# EAGLE design Atom_Multiout_Main (EAGLE 9.1.3)
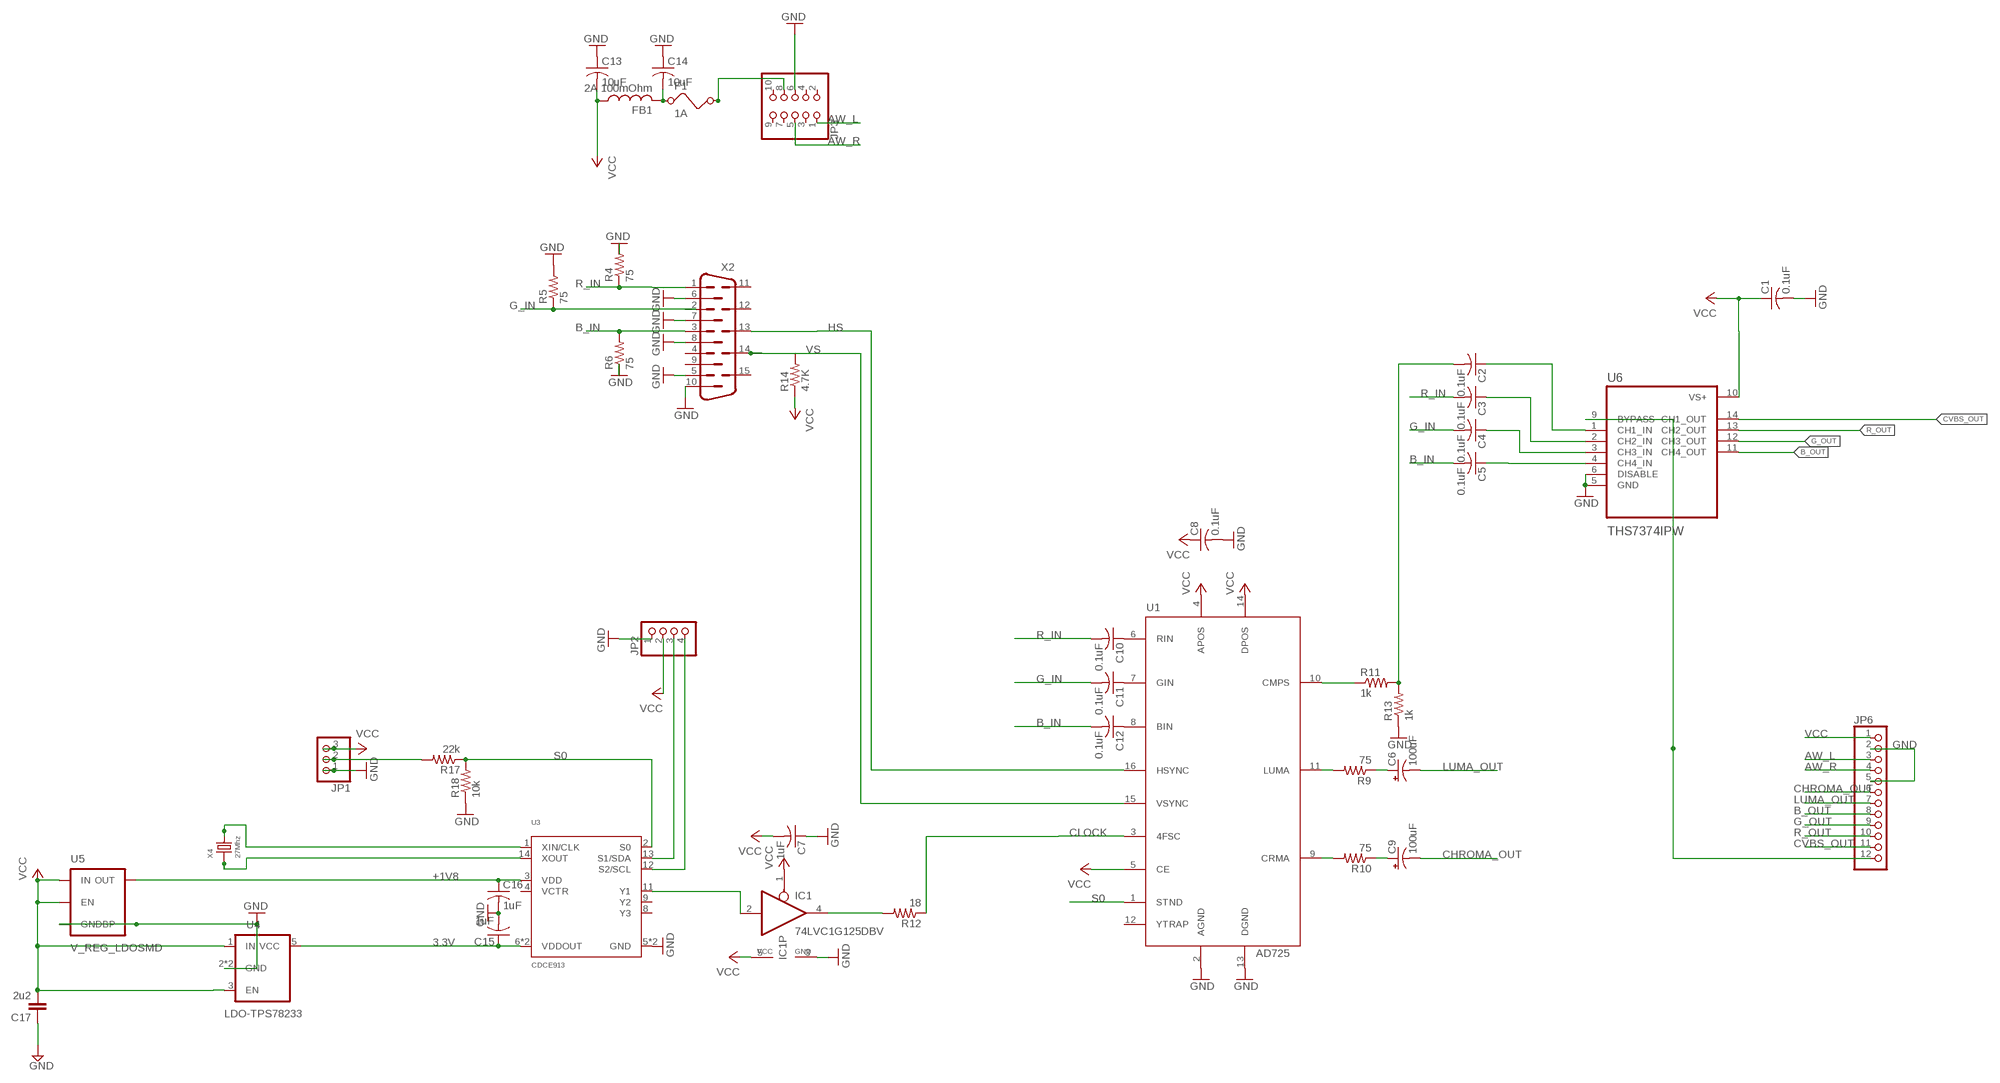
[diagram p0: schematic, sheet 1]

## Parts
C1  0.1uF  C-USC0603  [C0603@1]
C2  0.1uF  C-USC0603  [C0603@1]
C3  0.1uF  C-USC0603  [C0603@1]
C4  0.1uF  C-USC0603  [C0603@1]
C5  0.1uF  C-USC0603  [C0603@1]
C6  100uF  CPOL-USC/6032-28R  [C/6032-28R]
C7  1uF  C-USC0603  [C0603@1]
C8  0.1uF  C-USC0603  [C0603@1]
C9  100uF  CPOL-USC/6032-28R  [C/6032-28R]
C10  0.1uF  C-USC0603  [C0603@1]
C11  0.1uF  C-USC0603  [C0603@1]
C12  0.1uF  C-USC0603  [C0603@1]
C13  10uF  C-USC0603  [C0603@1]
C14  10uF  C-USC0603  [C0603@1]
C15  1uF  C-USC0603  [C0603@1]
C16  1uF  C-USC0603  [C0603@1]
C17  2u2  C-EUC0603  [C0603]
F1  1A  FUSEF  [1812]
FB1  2A 100mOhm  FERRITE-BEADB  [0805]
IC1  74LVC1G125DBV  [SOT23-5]
JP1  PINHD-1X03_2.54-S  [1X03-S]
JP2  PINHD-1X04_2.00  [1X04M]
JP3  PINHD-2X05_2.00  [2X05M]
JP6  PINHD-1X12_2.54-S  [1X12-S]
R4  75  R-US_R0603  [R0603]
R5  75  R-US_R0603  [R0603]
R6  75  R-US_R0603  [R0603]
R9  75  R-US_R0603  [R0603]
R10  75  R-US_R0603  [R0603]
R11  1k  R-US_R0603  [R0603]
R12  18  R-US_R0603  [R0603]
R13  1k  R-US_R0603  [R0603]
R14  4.7K  R-US_R0603  [R0603]
R17  22k  R-US_R0603  [R0603]
R18  10k  R-US_R0603  [R0603]
U1  AD725  [SOIC16W]
U3  CDCE913  [TSSOP14]
U4  LDO-TPS78233  [SOT23-5]
U5  V_REG_LDOSMD  [SOT23-5]
U6  THS7374IPW  [SOP65P640X120-14N]
X2  HM15V  [HDM15V]
X4  27Mhz  CRYSTAL'5032'  [X2-SMD-5.0X3.2X1.3MM]

## Nets
3.3V: C15.1 U3.6(VDDOUT) U3.7(VDDOUT) U4.5(VCC)
+1V8: C16.1 U3.3(VDD) U5.5(OUT)
AW_L: JP3.1 JP6.3
AW_R: JP3.5 JP6.4
B_IN: C5.2 C12.2 R6.2 X2.3
B_OUT: JP6.8 U6.11(CH4_OUT)
CHROMA_OUT: C9.- JP6.6
CLOCK: R12.1 U1.3(4FSC)
CVBS_OUT: JP6.11 U6.14(CH1_OUT)
G_IN: C4.2 C11.2 R5.1 X2.2
G_OUT: JP6.9 U6.12(CH3_OUT)
GND: C1.2 C7.1 C8.2 C13.1 C14.1 C15.2 C16.2 C17.1 IC1.3(GND) JP1.1 JP2.1 JP3.6 JP6.2 JP6.5 R4.2 R5.2 R6.1 R13.1 R18.1 U1.2(AGND) U1.13(DGND) U3.5(GND) U3.10(GND) U4.2(GND) U4.4(GND) U5.2(GND) U5.4(BP) U6.5(GND) U6.6(DISABLE) X2.5 X2.6 X2.7 X2.8 X2.10
HS: U1.16(HSYNC) X2.13
LPF: JP6.12 U6.9(BYPASS)
LUMA_OUT: C6.- JP6.7
N$6: C2.1 U6.1(CH1_IN)
N$7: IC1.4(O) R12.2
N$8: C4.1 U6.3(CH3_IN)
N$9: C3.1 U6.2(CH2_IN)
N$10: C5.1 U6.4(CH4_IN)
N$11: C2.2 R11.2 R13.2
N$12: R11.1 U1.10(CMPS)
N$13: C10.1 U1.6(RIN)
N$14: C11.1 U1.7(GIN)
N$15: C12.1 U1.8(BIN)
N$16: R9.2 U1.11(LUMA)
N$17: R10.2 U1.9(CRMA)
N$18: C6.+ R9.1
N$19: C9.+ R10.1
N$20: F1.2 JP3.8
N$21: C14.2 F1.1 FB1.2
N$22: IC1.2(I) U3.11(Y1)
N$24: JP1.2 R17.2
N$25: U3.1(XIN/CLK) X4.2
N$26: U3.14(XOUT) X4.1
N$27: JP2.3 U3.13(S1/SDA)
N$28: JP2.4 U3.12(S2/SCL)
R_IN: C3.2 C10.2 R4.1 X2.1
R_OUT: JP6.10 U6.13(CH2_OUT)
S0: R17.1 R18.2 U1.1(STND) U3.2(S0)
VCC: C1.1 C7.2 C8.1 C13.2 C17.2 FB1.1 IC1.1(OE) IC1.5(VCC) JP1.3 JP2.2 JP6.1 R14.1 U1.4(APOS) U1.5(CE) U1.14(DPOS) U4.1(IN) U4.3(EN) U5.1(IN) U5.3(EN) U6.10(VS+)
VS: R14.2 U1.15(VSYNC) X2.14
Unconnected: JP3.2 JP3.3 JP3.4 JP3.7 JP3.9 JP3.10 U1.12(YTRAP) U3.4(VCTR) U3.8(Y3) U3.9(Y2) X2.4 X2.9 X2.11 X2.12 X2.15

## Library data of the parts
C1-C5 C7 C8 C10-C16 = resistor:C-US: CAPACITOR, American symbol
C6 C9 = adafruit:CPOL-US: POLARIZED CAPACITOR, American symbol
C17 = resistor:C-EU: CAPACITOR, European symbol
F1 = m-pad-2.1:FUSE: Fuse's in various packages
FB1 = m-pad-2.1:FERRITE-BEAD: Ferrite beads in various packages
IC1 = 74xx-little-us:74*1G125: Single Bus Buffer Gate with 3-State Output
JP1 = pinhead-2:PINHD-1X03: PIN HEADER
JP2 = pinhead-2:PINHD-1X04: PIN HEADER
JP3 = pinhead-2:PINHD-2X05: PIN HEADER
JP6 = pinhead-2:PINHD-1X12: PIN HEADER
R4-R6 R9-R14 R17 R18 = resistor:R-US_: RESISTOR, American symbol
U1 = m-pad-2.1:AD725: Analog Devices AD725 Low Cost RGB to NTSC/PAL Encoder with Luma Trap Port Description: The AD725 is a very low cost general purpose RGB to NTSC/ PAL encoder that converts red, green and blue color component signals into their corresponding luminance (baseband amplitude) and chrominance (subcarrier amplitude and phase) signals in accordance with either NTSC or PAL standards. These two outputs are also combined on-chip to provide a composite video output. All three outputs are available separately at voltages of twice the standard signal levels as required for driving 75 Ohm, reverse-terminated cables. The AD725 features a luminance trap (YTRAP) pin that provides a means of reducing cross color generated by subcarrier frequency components found in the luminance signal. For portable or other power-sensitive applications, the device can be powered down to less than 1 uA of current consumption. All logic levels are TTL compatible thus supporting the logic requirements of 3 V CMOS systems. The AD725 is packaged in a low cost 16-lead SOIC and operates from a +5 V supply. Features: Composite Video Output: Both NTSC and PAL Chrominance and Luminance (S-Video) Outputs Luma Trap Port to Eliminate Cross Color Artifacts TTL Logic Levels Integrated Delay Line and Auto-Tuned Filters Drives 75 Ohm Reverse-Terminated Loads Low Power +5 V Operation Power-Down to less then 1 uA Very Low Cost Applications: RGB/VGA to NTSC/PAL Encoding Personal Computers/Network Computers Video Games Video Conference Cameras Digital Still Cameras Please send any comments to: messi@users.sourceforge.net
U3 = TRP_Custom:CDCE913: CDCEx913 Programmable 1-PLL VCXO Clock Synthesizer With 1.8-V, 2.5-V, and 3.3-V Outputs http://www.ti.com/product/CDCE913
U4 = SparkFun-PowerIC:LDO-TPS78233: Voltage Regulator LDO 500nA Ground Current, 150mA, Ultra-Low Quiescent Current Low-Dropout Linear Regulator.
U5 = SparkFun-PowerIC:V_REG_LDO: Voltage Regulator LDO Standard 150mA LDO voltage regulator in SOT-23 layout. Micrel part MIC5205. BP (by-pass) pin is used to lower output noise with 470pF cap.
U6 = THS7374IPW:THS7374IPW: Check availability <https://pricing.snapeda.com/parts/THS7374IPW/Texas%20Instruments/view-part?ref=eda>; AVAILABILITY: In Stock; DESCRIPTION: 4-Ch SDTV (Component and Composite) Video Amplifier with 9.5MHz Filters and 6dB Gain; MF: Texas Instruments; MP: THS7374IPW; PACKAGE: TSSOP-14 Texas Instruments; PRICE: None; PURCHASE-URL: https://pricing.snapeda.com/search/part/THS7374IPW/?ref=eda
X2 = con-subd:HM15: SUB-D; OC_FARNELL: unknown; OC_NEWARK: unknown
X4 = Seeed-OPL-Crystal-Oscillator:CRYSTAL

## Board
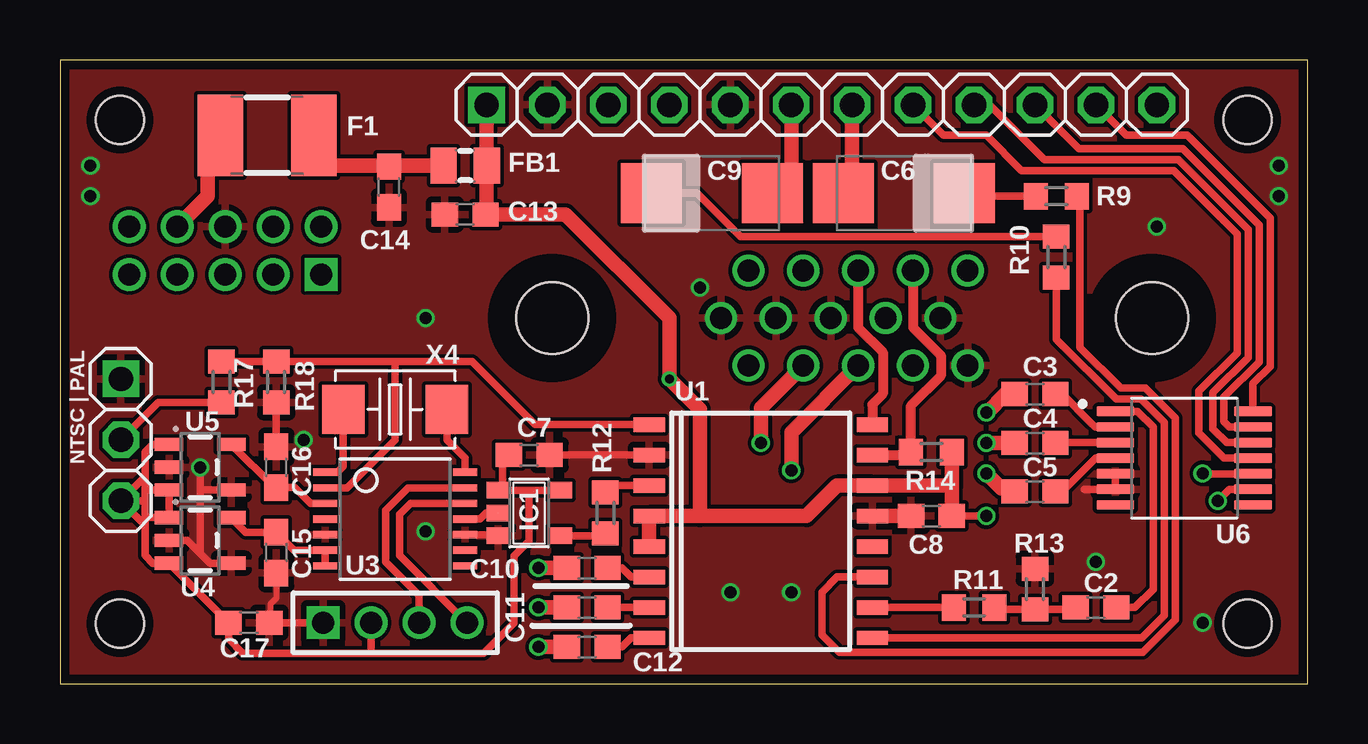
[diagram p1: board, top side]
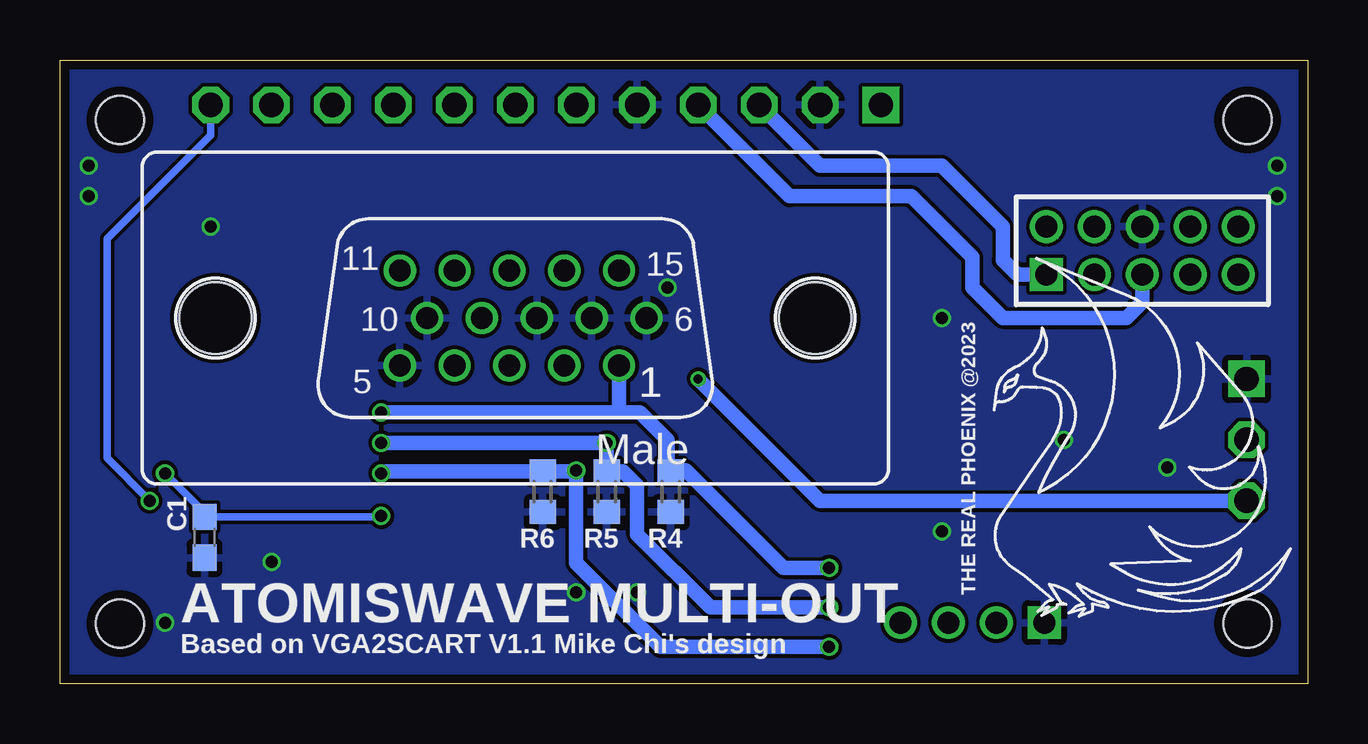
[diagram p2: board, bottom side, seen from below]

Size 52 x 26 mm. Coordinates in mm from the lower left corner, seen from the top.
Outline: 0,0 52,0 52,26 0,26 0,0
Copper layers (1*16): Top 0.035559375mm / dielectric 1.6mm / Bottom 0.035559375mm
Design rules "oshpark-2layer": minimum track width 6mil, minimum drill 10mil, track to track 6mil, track to pad 6mil, pad to pad 6mil, via to via 6mil, smd to smd 6mil, copper to edge 15mil, drill to drill 6mil, minimum pad ring 5mil, minimum via ring 5mil, stop-mask expansion 2.5mil, vias tented up to drill 30mil, thermal gap 10mil
Holes 2 mm at 49.5,23.5 2.5,23.5 2.5,2.5 49.5,2.5

### Footprints (pad centres in the part's own frame; a part is rotated, then mirrored left to right if it is on the bottom)
C0603@1 = smd 1.1 x 1: 1 -0.85,0; 2 0.85,0
C/6032-28R = smd 2.55 x 2.5: + 2.525,0; - -2.525,0
C0603 = smd 1.1 x 1: 1 -0.85,0; 2 0.85,0
1812 = smd 1.9 x 3.4: 1 -1.95,0; 2 1.95,0
0805 = smd 1.1 x 1.5: 1 -0.9,0; 2 0.9,0
SOT23-5 = smd 0.69 x 0.99: 1 -0.95,-1.29; 2 0,-1.29; 3 0.95,-1.29; 4 0.95,1.3; 5 -0.95,1.3
1X03-S = drill 1.016 square: 1 -2.54,0 | drill 1.016 octagon: 2 0,0; 3 2.54,0
1X04M = drill 0.914 square: 1 -3,0 | drill 0.914: 2 -1,0; 3 1,0; 4 3,0
2X05M = drill 0.914 square: 1 -4,-1 | drill 0.914: 2 -4,1; 3 -2,-1; 4 -2,1; 5 0,-1; 6 0,1; 7 2,-1; 8 2,1; 9 4,-1; 10 4,1
1X12-S = drill 1.016 square: 1 -13.97,0 | drill 1.016 octagon: 2 -11.43,0; 3 -8.89,0; 4 -6.35,0; 5 -3.81,0; 6 -1.27,0; 7 1.27,0; 8 3.81,0; 9 6.35,0; 10 8.89,0; 11 11.43,0; 12 13.97,0
R0603 = smd 1 x 1.1: 1 -0.85,0; 2 0.85,0
SOIC16W = smd 0.6 x 1.3: 1 -4.445,-4.65; 2 -3.175,-4.65; 3 -1.905,-4.65; 4 -0.635,-4.65; 5 0.635,-4.65; 6 1.905,-4.65; 7 3.175,-4.65; 8 4.445,-4.65; 9 4.445,4.65; 10 3.175,4.65; 11 1.905,4.65; 12 0.635,4.65; 13 -0.635,4.65; 14 -1.905,4.65; 15 -3.175,4.65; 16 -4.445,4.65
TSSOP14 = smd 0.305 x 0.991: 1 -1.95,-2.918; 2 -1.3,-2.918; 3 -0.65,-2.918; 4 0,-2.918; 5 0.65,-2.918; 6 1.3,-2.918; 7 1.95,-2.918; 8 1.95,2.918; 9 1.3,2.918; 10 0.65,2.918; 11 0,2.918; 12 -0.65,2.918; 13 -1.3,2.918; 14 -1.95,2.918
SOT23-5' = smd 0.55 x 1.2: 1 -0.95,-1.3; 2 0,-1.3; 3 0.95,-1.3; 4 0.95,1.3; 5 -0.95,1.3
SOP65P640X120-14N = smd 1.57 x 0.41: 1 -2.87,1.95; 2 -2.87,1.3; 3 -2.87,0.65; 4 -2.87,0; 5 -2.87,-0.65; 6 -2.87,-1.3; 7 -2.87,-1.95; 8 2.87,-1.95; 9 2.87,-1.3; 10 2.87,-0.65; 11 2.87,0; 12 2.87,0.65; 13 2.87,1.3; 14 2.87,1.95
HDM15V = drill 0.9: 1 -4.324,1.98; 2 -2.038,1.98; 3 0.248,1.98; 4 2.534,1.98; 5 4.82,1.98; 6 -5.467,0; 7 -3.181,0; 8 -0.895,0; 9 1.391,0; 10 3.677,0; 11 -4.324,-1.98; 12 -2.038,-1.98; 13 0.248,-1.98; 14 2.534,-1.98; 15 4.82,-1.98 | hole 3: -12.5,0; 12.5,0
X2-SMD-5.0X3.2X1.3MM = smd 1.778 x 2.032: 1 -2.159,0; 2 2.159,0

### Placement (x,y rotation side)
C1  45.97,6.1 270 bottom
C2  43.18,3.17 180 top
C3  40.64,12.06 180 top
C4  40.64,10.03 180 top
C5  40.64,8 180 top
C6  35.18,20.45 0 top
C7  19.56,9.53 180 top
C8  36.32,6.99 180 top
C9  27.18,20.45 180 top
C10  21.97,4.83 180 top
C11  21.97,3.17 180 top
C12  21.97,1.52 180 top
C13  16.89,19.56 0 top
C14  13.72,20.7 90 top
C15  9.02,5.46 270 top
C16  9.02,9.02 90 top
C17  7.87,2.54 180 top
F1  8.64,22.86 180 top
FB1  16.89,21.59 180 top
IC1  19.56,7.11 270 top
JP1  2.54,10.16 270 top
JP2  13.97,2.54 0 top
JP3  6.89,18.05 0 bottom
JP6  31.75,24.13 0 top
R4  26.54,8 270 bottom
R5  29.21,8 270 bottom
R6  31.88,8 90 bottom
R9  41.53,20.32 0 top
R10  41.53,17.78 270 top
R11  38.1,3.17 0 top
R12  22.73,7.11 270 top
R13  40.64,3.94 270 top
R14  36.32,9.65 180 top
R17  6.73,12.57 270 top
R18  9.02,12.57 90 top
U1  29.21,6.35 270 top
U3  13.97,6.86 270 top
U4  LDO-TPS78233  [SOT23-5']  5.84,5.97 270 top
U5  V_REG_LDOSMD  [SOT23-5']  5.84,9.02 270 top
U6  46.86,9.4 0 top
U$1  [LOGO]  16.51,1.27 0 bottom
X2  33.02,15.24 180 bottom
X4  13.97,11.43 180 top

### Tracks (layer width: path | path; a pad name or v marks a point on that pad's centre or on a via)
3.3V
  Top 0.305: U3.7 U3.6 9.77,5.56 C15.1 7.75,6.31 U4.5
+1V8
  Top 0.305: U3.3 10.44,7.51 9.78,8.17 C16.1 8.94,8.17 U5.5
AW_L
  Bottom 0.61: JP3.1 12.1,17.05 12.7,17.65 12.7,19.05 15.24,21.59 20.32,21.59 JP6.3
AW_R
  Bottom 0.61: JP3.5 6.89,15.91 7.56,15.24 12.7,15.24 13.97,16.51 13.97,17.78 16.51,20.32 21.59,20.32 JP6.4
B_IN  (via drill 0.5)
  Top 0.61: C12.2 v19.94,1.52 | C5.2 39.66,8 39.54,8.13 39.24,8.13 v38.61,8.76 | X2.3 30.48,10.47 v30.48,8.89
  Bottom 0.61: v19.94,1.52 26.96,1.52 30.48,5.04 v30.48,8.89 30.52,8.85 R6.2 38.52,8.85 v38.61,8.76
B_OUT
  Top 0.305: U6.11 48.51,9.4 47.47,10.44 47.47,12.19 49.07,13.79 49.07,18.75 46.43,21.39 40.08,21.39 38.61,22.86 36.83,22.86 JP6.8
CHROMA_OUT
  Top 0.61: JP6.6 30.48,20.45 C9.-
CLOCK
  Top 0.305: U1.3 23.03,8.26 R12.1
CVBS_OUT
  Top 0.305: U6.14 49.73,12.5 50.45,13.22 50.45,19.41 46.99,22.86 44.45,22.86 JP6.11
G_IN  (via drill 0.5)
  Top 0.61: C11.2 v19.94,3.17 | C4.2 v38.61,10.03 | X2.2 29.21,11.49 v29.21,10.03
  Bottom 0.61: v19.94,3.17 24.89,3.17 27.94,6.22 27.94,7.62 27.94,8.26 28.54,8.85 R5.1 v29.21,10.03 v38.61,10.03
G_OUT
  Top 0.305: U6.12 48.63,10.05 48.06,10.62 48.06,12.13 49.53,13.6 49.53,18.93 46.62,21.84 41.02,21.84 38.73,24.13 JP6.9
GND  (via drill 0.5)
  Top 0.254: C15.2 9.02,3.56 8.76,3.3 8.76,2.58 C17.1
  Top 0.305: IC1.3 18.09,6.21 U3.10 | U1.2 C7.1 | 5.84,5.43 5.3,5.97 U4.2 | C17.1 JP2.1 | U4.4 6.25,5.02 5.89,5.38 5.84,5.43 | v5.84,9.02 5.84,8.13 | 5.84,8.13 5.84,5.43 | U5.4 5.9,8.07 5.84,8.13 | R18.1 C16.2 | U6.5 U6.6 42.7,8.1
  Top 0.61: C8.2 U1.13
  other vias: 26.67,16.51 27.94,3.81 15.24,6.35 30.48,3.81 43.18,5.08 50.8,21.59 1.27,20.32 1.27,21.59 50.8,20.32 10.16,10.16 47.62,2.54 45.72,19.05 15.24,15.24
  pour Top: 0,26.04 52.07,26.04 52.07,0 0,0
  pour Bottom: 0,26 52,26 52,0 0,0
HS
  Top 0.406: X2.13 33.27,14.84 34.3,13.81 34.3,12.07 33.86,11.63 U1.16
LPF  (via drill 0.5)
  Top 0.305: U6.9 48.74,8.1 v48.26,7.62
  Bottom 0.305: JP6.12 45.72,22.86 50.04,18.54 50.04,9.4 v48.26,7.62
LUMA_OUT
  Top 0.61: C6.- 33.02,20.45 JP6.7
N$6
  Top 0.305: U6.1 44.91,11.35 45.57,10.69 45.57,3.94 44.81,3.17 C2.1
N$7
  Top 0.305: IC1.4 22.73,6.16 R12.2
N$8
  Top 0.305: C4.1 41.52,10.06 41.53,10.05 U6.3
N$9
  Top 0.305: C3.1 41.78,12.06 42.98,10.87 43.16,10.69 43.16,10.7 U6.2
N$10
  Top 0.305: C5.1 41.78,8 43.18,9.4 U6.4
N$11
  Top 0.305: C2.2 42.24,3.09 R13.2 39.04,3.09 R11.2
N$12
  Top 0.305: R11.1 U1.10
N$13
  Top 0.305: C10.1 23.42,4.83 23.8,4.45 U1.6
N$14
  Top 0.305: U1.7 C11.1
N$15
  Top 0.305: C12.1 23.42,1.52 23.8,1.91 U1.8
N$16
  Top 0.305: U1.11 32.38,4.45 31.75,3.81 31.75,2.03 32.48,1.3 45.13,1.3 46.48,2.65 46.48,11.07 45.24,12.31 44.21,12.31 42.52,14.01 42.52,20.18 R9.2
N$17
  Top 0.305: U1.9 45.09,1.91 46.02,2.85 46.02,10.88 45.05,11.86 44.02,11.86 41.53,14.35 R10.2
N$18
  Top 0.305: R9.1 37.83,20.32 C6.+
N$19
  Top 0.305: R10.1 28.36,18.63 26.54,20.45 C9.+
N$20
  Top 0.61: JP3.8 6.16,20.32 6.16,22.86 F1.2
N$21
  Top 0.61: FB1.2 13.97,21.59 13.76,21.59 | 13.76,21.59 10.59,21.59 F1.1 | C14.2 13.76,21.59
N$22
  Top 0.305: U3.11 17.51,6.86 17.76,7.11 IC1.2
N$24
  Top 0.305: 6.44,11.43 R17.2 4.1,11.72 JP1.2
N$25
  Top 0.305: X4.2 11.81,9.06 11.56,8.81 U3.1
N$26
  Top 0.305: U3.14 16.89,9.4 16.13,10.16 X4.1
N$27
  Top 0.305: U3.13 14.51,8.16 13.57,7.22 13.57,5.08 14.97,3.68 JP2.3
N$28
  Top 0.305: U3.12 15.24,7.51 14.62,7.51 14.16,7.04 14.16,5.33 16.95,2.54 JP2.4
R_IN  (via drill 0.5)
  Top 0.61: C10.2 v19.94,4.83 | v38.61,11.3 38.65,11.3 39.41,12.06 C3.2
  Bottom 0.61: R4.1 26.5,8.89 | 26.5,8.89 25.91,8.89 21.84,4.83 v19.94,4.83 | v38.61,11.3 28.7,11.3 | X2.1 28.7,11.31 28.7,11.3 | 28.7,11.3 27.81,11.3 26.67,10.16 26.67,9.06 26.5,8.89
R_OUT
  Top 0.305: U6.13 48.74,10.69 48.51,10.92 48.51,11.94 49.99,13.41 49.99,19.12 46.81,22.3 42.47,22.3 JP6.10
S0
  Top 0.305: U1.1 19.81,10.79 17.18,13.42 13.97,13.42 | U3.2 11.97,8.16 13.97,10.16 13.97,13.42 | R17.1 R18.2 13.97,13.42
VCC  (via drill 0.38, 0.5)
  Top 0.305: 19.56,8.05 19.56,5.95 18.92,5.32 18.92,2.54 17.65,1.27 12.97,1.27 | 12.97,1.27 JP2.2 | 12.97,1.27 7.62,1.27 7.02,1.87 C17.2 U4.3 3.87,5.02 3.56,5.33 3.56,6.35 3.56,6.6 | U4.1 U5.3 3.62,8.07 3.56,8.13 | C8.1 v38.61,6.99 | v47.62,8.76 47.62,8.75 U6.10 | C7.2 18.45,9.53 18.45,8.06 IC1.1 19.56,8.05 | IC1.5 19.57,8.06 19.56,8.05 | U4.1 | U5.1 3.87,9.97 3.56,9.65 3.56,8.64 | 3.56,8.64 3.56,8.13 | 3.56,8.13 3.56,7.62 | 3.56,6.99 3.56,7.62 | 3.56,6.99 3.56,6.6 | U4.1 3.62,6.92 3.56,6.99 | 3.56,7.62 JP1.3 | JP1.3 3.56,8.64 | JP1.3 3.56,6.6
  Top 0.61: U1.5 U1.4 26.67,6.99 | C8.1 37.17,8.13 | 37.17,8.13 37.05,8.26 U1.14 32.38,8.26 31.11,6.99 26.67,6.99 | R14.1 37.17,8.13 | 26.67,6.99 26.67,11.43 v25.4,12.7 25.4,15.24 21.08,19.56 C13.2 17.79,19.61 FB1.1 17.79,24.12 JP6.1
  Bottom 0.305: v38.61,6.99 38.65,6.95 C1.1 45.97,7.11 v47.62,8.76
  Bottom 0.61: JP1.3 20.32,7.62 v25.4,12.7
VS
  Top 0.406: U1.15 35.34,9.53 | X2.14 35.55,14.84 36.71,13.69 36.71,12.83 35.47,11.59 R14.2
  Top 0.508: 35.34,9.53 R14.2

### Text on the board
tPlace: NTSC | PAL
bPlace: THE REAL PHOENIX @2023 | ATOMISWAVE MULTI-OUT | Based on VGA2SCART V1.1 Mike Chi's design